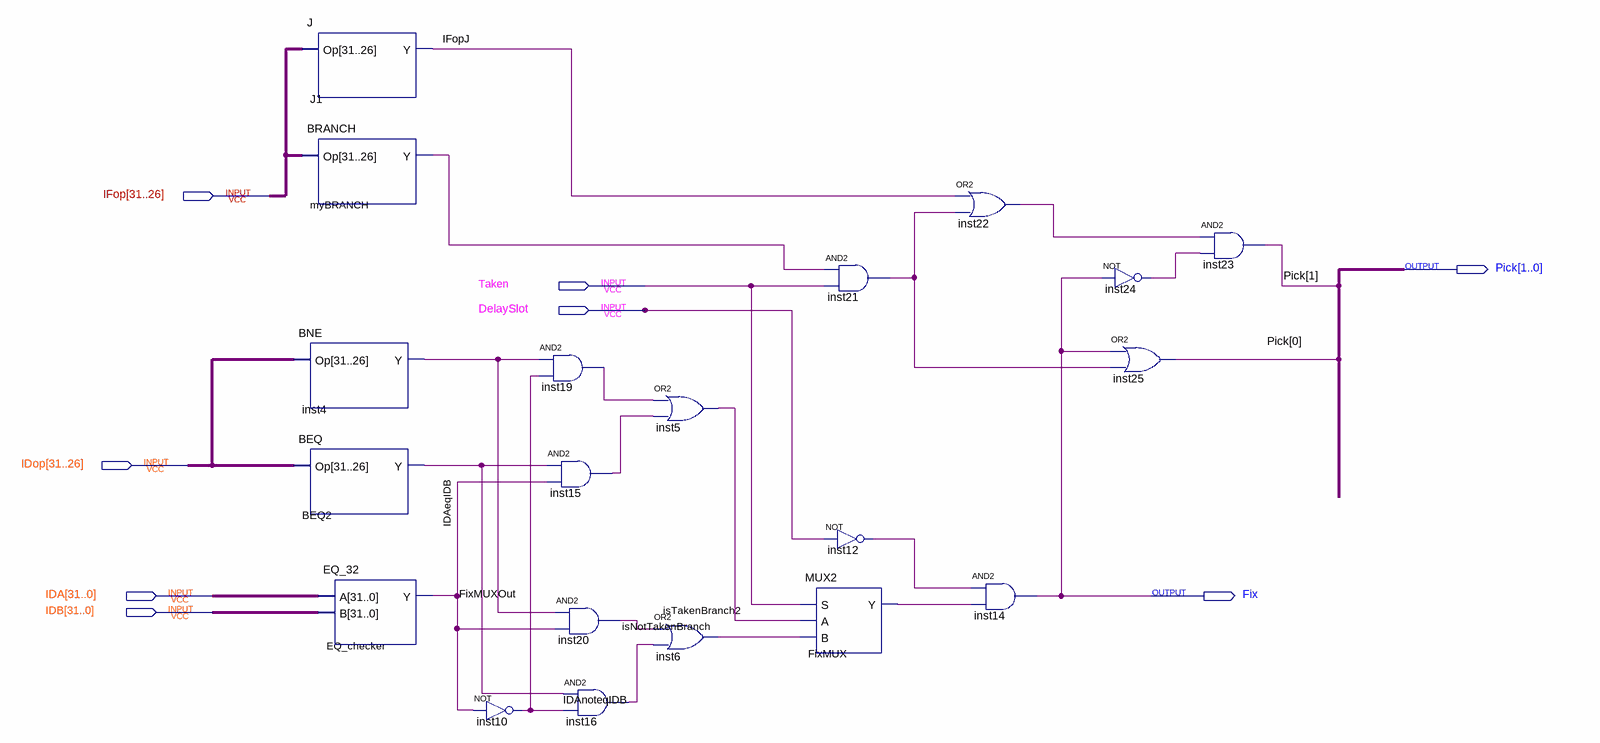
[diagram p0: schematic sheet]
// Quartus schematic Branch_Prediction.bdf as structural Verilog: 20 symbols, 8 pins
module Branch_Prediction (
  input  [31:26] IFop,
  input  Taken,
  input  DelaySlot,
  input  [31:26] IDop,
  input  [31:0] IDA,
  input  [31:0] IDB,
  output [1:0] Pick,
  output Fix
);

  wire BEQ2_y, FixMUXOut, IDAeqIDB, IDAnoteqIDB, IFopJ, inst4_y, inst12_out, inst15_out, inst16_out,
       inst19_out, inst20_out, inst21_out, inst22_out, inst24_out, isNotTakenBranch, isTakenBranch2,
       myBRANCH_y;

  J J1 (.Op(IFop), .Y(IFopJ));
  BRANCH myBRANCH (.Op(IFop), .Y(myBRANCH_y));
  BNE inst4 (.Op(IDop), .Y(inst4_y));
  BEQ BEQ2 (.Op(IDop), .Y(BEQ2_y));
  EQ_32 EQ_checker (.A(IDA), .B(IDB), .Y(IDAeqIDB));
  not inst10 (IDAnoteqIDB, IDAeqIDB);
  and inst19 (inst19_out, inst4_y, IDAnoteqIDB);
  and inst15 (inst15_out, BEQ2_y, IDAeqIDB);
  and inst20 (inst20_out, inst4_y, IDAeqIDB);
  and inst16 (inst16_out, BEQ2_y, IDAnoteqIDB);
  or inst5 (isTakenBranch2, inst19_out, inst15_out);
  or inst6 (isNotTakenBranch, inst20_out, inst16_out);
  and inst21 (inst21_out, myBRANCH_y, Taken);
  not inst12 (inst12_out, DelaySlot);
  MUX2 FixMUX (.S(Taken), .A(isTakenBranch2), .B(isNotTakenBranch), .Y(FixMUXOut));
  or inst22 (inst22_out, IFopJ, inst21_out);
  and inst14 (Fix, inst12_out, FixMUXOut);
  not inst24 (inst24_out, Fix);
  or inst25 (Pick[0], Fix, inst21_out);
  and inst23 (Pick[1], inst22_out, inst24_out);
endmodule
